# EAGLE schematic ArduSensor-Shield-V1 (EAGLE 6.0)
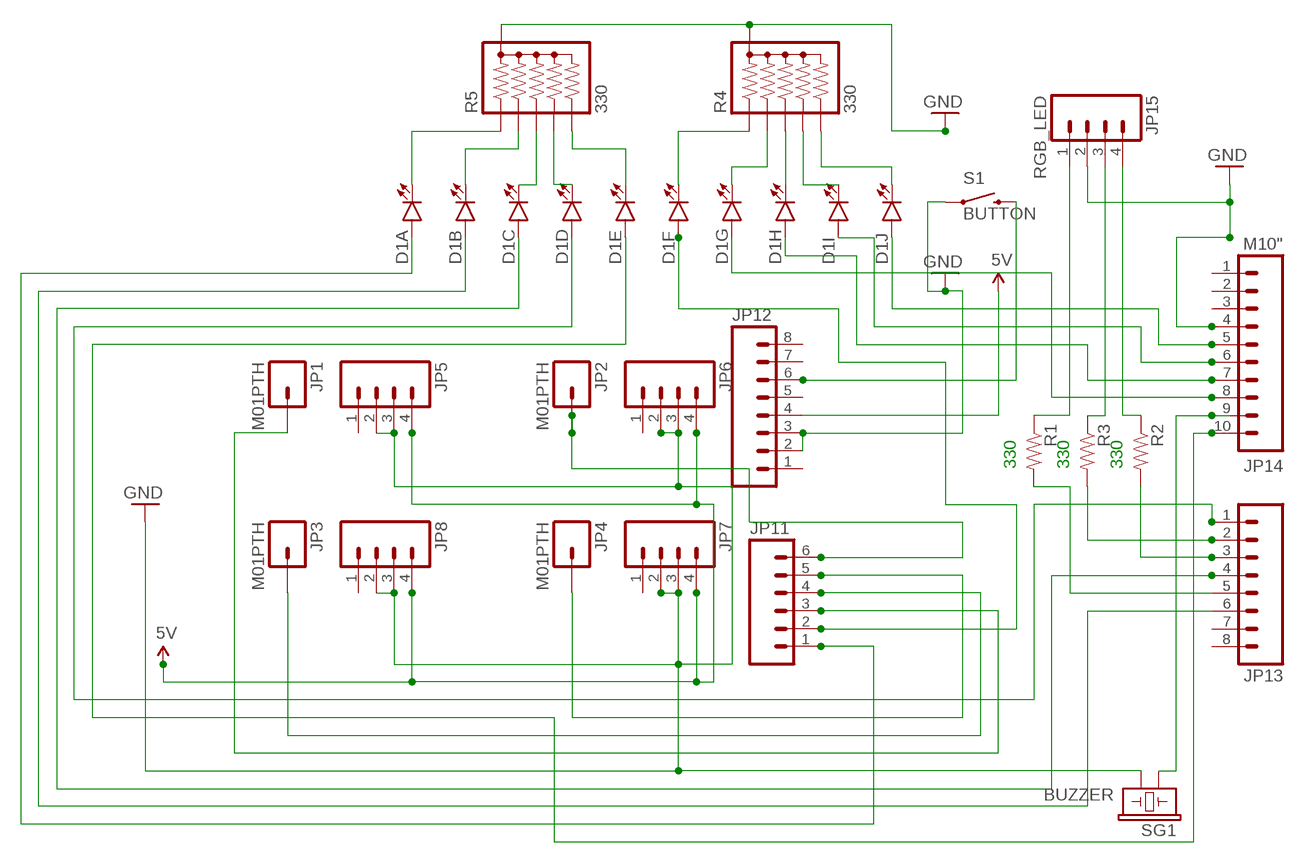
[diagram p0: schematic, sheet 1]

## Parts
D1  LED_BARGRAPH_10  [LED_BARGAPH_10]
JP1  M01PTH  [1X01]
JP2  M01PTH  [1X01]
JP3  M01PTH  [1X01]
JP4  M01PTH  [1X01]
JP5  M04PTH  [1X04]
JP6  M04PTH  [1X04]
JP7  M04PTH  [1X04]
JP8  M04PTH  [1X04]
JP11  M06SIP  [1X06]
JP12  M081X08  [1X08]
JP13  M081X08  [1X08]
JP14  M10"  [1X10]
JP15  RGB_LED  M04PTH  [1X04]
R1  RESISTORPTH-1/6W  [1/6W-RES]
R2  RESISTORPTH-1/6W  [1/6W-RES]
R3  RESISTORPTH-1/6W  [1/6W-RES]
R4  330  RPACK-BUSSED-SIP-PTH-5  [RPACK-SIP-PTH-5]
R5  330  RPACK-BUSSED-SIP-PTH-5  [RPACK-SIP-PTH-5]
S1  BUTTON  SWITCH-MOMENTARY-2PTH  [TACTILE-PTH]
SG1  BUZZER  BUZZERPTH  [BUZZER-12MM]

## Nets
5V: JP5.4 JP6.4 JP7.4 JP8.4 JP12.4
GND: JP5.2 JP5.3 JP6.2 JP6.3 JP7.2 JP7.3 JP8.2 JP8.3 JP12.2 JP12.3 JP14.4 JP15.2 R4.P$1 S1.1 SG1.-
N$1: D1.5(E:A) JP14.10
N$2: JP13.5 R1.2
N$3: JP13.2 R3.2
N$4: JP13.3 R2.2
N$5: JP14.9 SG1.+
N$7: D1.7(G:A) JP14.8
N$9: JP15.1 R1.1
N$10: JP2.1 JP11.6
N$11: JP4.1 JP11.5
N$12: JP1.1 JP11.3
N$13: JP15.4 R2.1
N$14: D1.6(F:A) JP11.2
N$15: JP3.1 JP11.4
N$16: D1.9(I:A) JP14.6
N$17: D1.11(J:C) R4.P$6
N$18: D1.12(I:C) R4.P$5
N$19: D1.13(H:C) R4.P$4
N$20: D1.14(G:C) R4.P$3
N$21: D1.15(F:C) R4.P$2
N$22: D1.10(J:A) JP14.5
N$23: D1.16(E:C) R5.P$6
N$24: D1.17(D:C) R5.P$5
N$25: D1.18(C:C) R5.P$4
N$26: D1.19(B:C) R5.P$3
N$27: D1.20(A:C) R5.P$2
N$28: JP15.3 R3.1
N$29: D1.3(C:A) JP13.4
N$30: D1.2(B:A) JP13.6
N$31: D1.1(A:A) JP11.1
N$32: D1.4(D:A) JP13.1
N$36: JP12.6 S1.3
N$40: D1.8(H:A) JP14.7
Unconnected: JP5.1 JP6.1 JP7.1 JP8.1 JP12.1 JP12.5 JP12.7 JP12.8 JP13.7 JP13.8 JP14.1 JP14.2 JP14.3 R5.P$1

## Notes on the sheet
- 330 | 330 | 330

## Library data of the parts
D1 = SFE LED:LED_BARGRAPH_10: 10-Segment LED Bar Graph SFE part numbers: COM-09935 (red, Vf = 2.1V, Ifmax = 20mA) COM-09936 (yellow, Vf = 2.1V, Ifmax = 20mA) COM-09937 (blue, Vf = 3.4V, Ifmax = 20mA) COM-09938 (green, Vf = 3.4V, Ifmax = 20mA)
JP1-JP4 = SFE Connectors:M01: Header 1 Standard 1-pin 0.1" header. Use with straight break away headers (SKU : PRT-00116), right angle break away headers (PRT-00553), swiss pins (PRT-00743), machine pins (PRT-00117), and female headers (PRT-00115).
JP5-JP8 JP15 = SFE Connectors:M04: Header 4 Standard 4-pin 0.1" header. Use with straight break away headers (SKU : PRT-00116), right angle break away headers (PRT-00553), swiss pins (PRT-00743), machine pins (PRT-00117), and female headers (PRT-00115). Molex polarized connector foot print use with SKU : PRT-08231 with associated crimp pins and housings. 1MM SMD Version SKU: PRT-10208
JP11 = SFE Connectors:M06: Header 6 Standard 6-pin 0.1" header. Use with straight break away headers (SKU : PRT-00116), right angle break away headers (PRT-00553), swiss pins (PRT-00743), machine pins (PRT-00117), and female headers (PRT-00115). Molex polarized connector foot print use with SKU : PRT-08094 with associated crimp pins and housings. NOTES ON THE VARIANTS LOCK and LOCK_LONGPADS... This footprint was designed to help hold the alignment of a through-hole component (i.e. 6-pin header) while soldering it into place. You may notice that each hole has been shifted either up or down by 0.005 of an inch from it's more standard position (which is a perfectly straight line). This slight alteration caused the pins (the squares in the middle) to touch the edges of the holes. Because they are alternating, it causes a "brace" to hold the component in place. 0.005 has proven to be the perfect amount of "off-center" position when using our standard breakaway headers. Although looks a little odd when you look at the bare footprint, once you have a header in there, the alteration is very hard to notice. Also, if you push a header all the way into place, it is covered up entirely on the bottom side. This idea of altering the position of holes to aid alignment will be further integrated into the Sparkfun Library for other footprints. It can help hold any component with 3 or more connection pins.
JP12 JP13 = SFE Connectors:M08: Header 8 Standard 8-pin 0.1" header. Use with straight break away headers (SKU : PRT-00116), right angle break away headers (PRT-00553), swiss pins (PRT-00743), machine pins (PRT-00117), and female headers (PRT-00115).
JP14 = SFE Connectors:M10: Header 10 Standard 10-pin 0.1" header. Use with straight break away headers (SKU : PRT-00116), right angle break away headers (PRT-00553), swiss pins (PRT-00743), machine pins (PRT-00117), and female headers (PRT-00115).
R1-R3 = SFE Passives:RESISTOR: Resistor Basic schematic elements and footprints for 0603, 1206, and PTH resistors.
R4 R5 = SFE Passives:RPACK*: BOURNS 4600X series thick-film SIP resistor packs Five resistors bussed to a single pin (denoted by dot). 0.2W / resistor datasheet <http://dlnmh9ip6v2uc.cloudfront.net/datasheets/Components/General/4600x.pdf> SFE parts COM-10855 (330), COM-10856 (10K)
S1 = SFE Electromechanical:SWITCH-MOMENTARY-2: Various NO switches- pushbuttons, reed, etc
SG1 = SFE Electromechanical:BUZZER: Buzzer 12mm Spark Fun Electronics SKU : Comp-Buzzer